# Altium project PFC_Project.PrjPcb
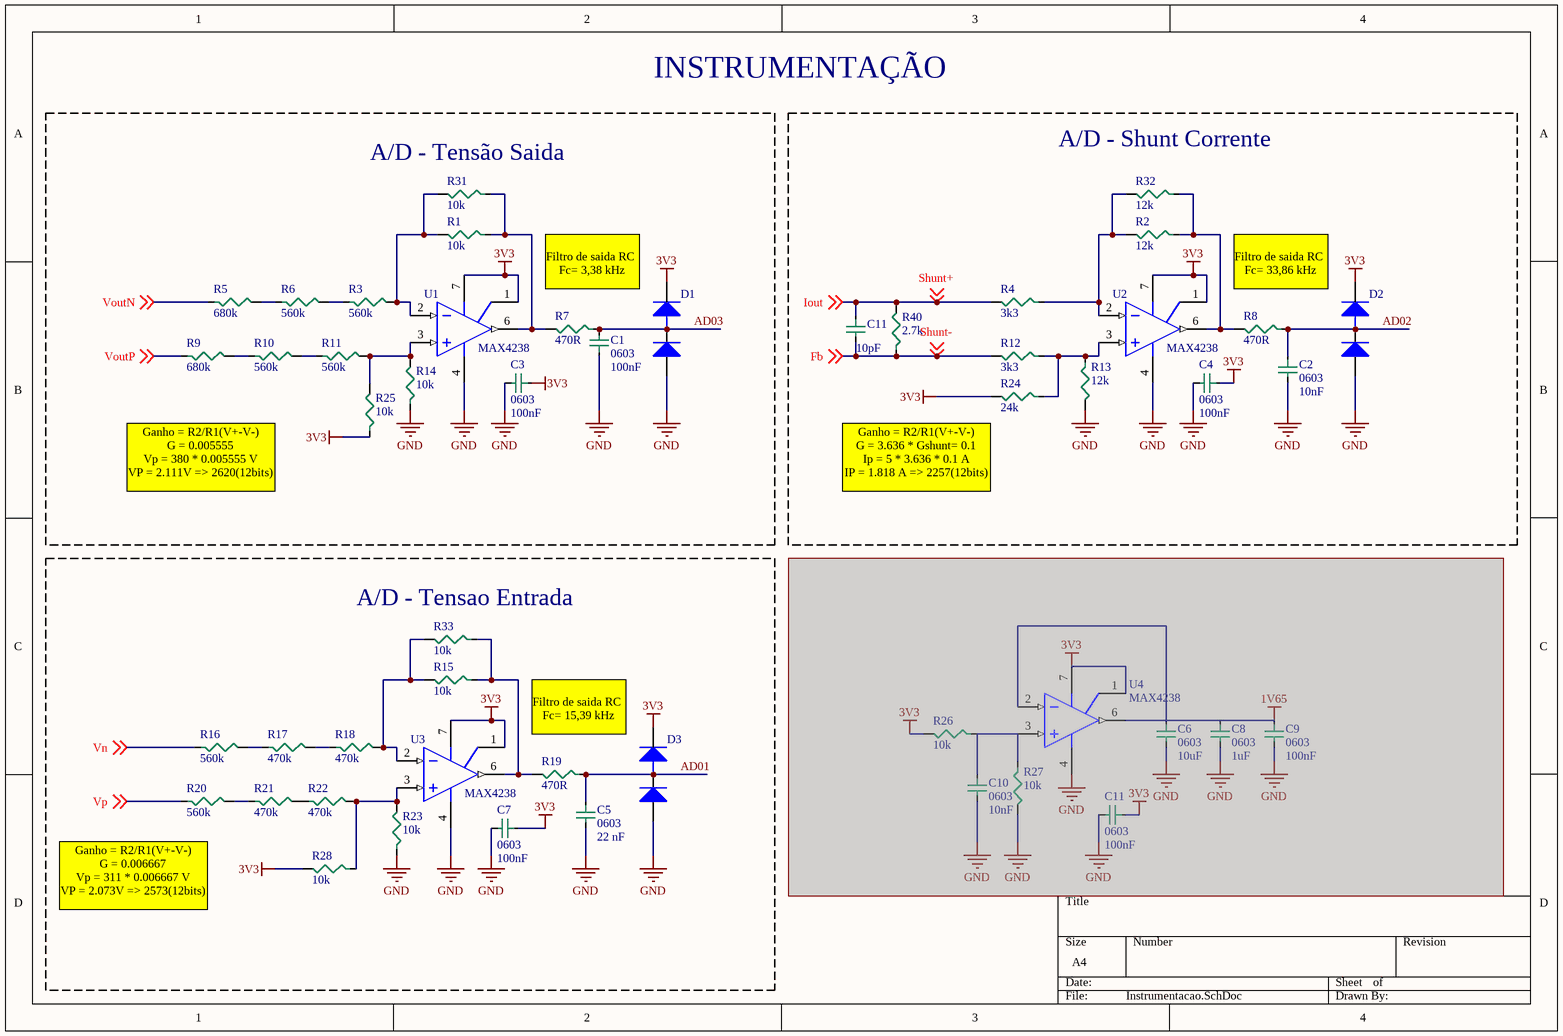
[diagram p0: Instrumentacao.SchDoc]
2 sheets, 88 parts. Net scope: global (net labels, ports and power ports of the same name join across sheets).
Board file: PCBv2.PcbDoc
Sheets:
  Instrumentacao.SchDoc
  PFC.SchDoc

## Sheet Instrumentacao.SchDoc
size A4

### Parts
(Parts that share a designator on the sheet are numbered #1, #2 ... from top to bottom, then left to right.)
C1  0603  value 100nF  [0603C]
C2  0603  value 10nF  [0603C]
C3  0603  value 100nF  [0603C]
C4  0603  value 100nF  [0603C]
C5  0603  value 22 nF  [0603C]
C6  0603  value 10uF  [0603C]  (masked out: inside a compile mask, not in the netlist)
C7  0603  value 100nF  [0603C]
C8  0603  value 1uF  [0603C]  (masked out: inside a compile mask, not in the netlist)
C9  0603  value 100nF  [0603C]  (masked out: inside a compile mask, not in the netlist)
C10  0603  value 10nF  [0603C]  (masked out: inside a compile mask, not in the netlist)
C11#1  value 10pF  [0603C]  (hidden comment: 0603)
C11#2  0603  value 100nF  [0603C]  (masked out: inside a compile mask, not in the netlist)
D1#1  BAT54S  [SOT23]  (value not drawn)
D2  BAT54S  [SOT23]  (value not drawn)
D3  BAT54S  [SOT23]  (value not drawn)
R1  value 10k  [0603]  (hidden comment: 0603)
R2  value 12k  [0603]  (hidden comment: 0603)
R3  value 560k  [0603]  (hidden comment: 0603)
R4  value 3k3  [0603]  (hidden comment: 0603)
R5  value 680k  [0603]  (hidden comment: 0603)
R6  value 560k  [0603]  (hidden comment: 0603)
R7  value 470R  [0603]  (hidden comment: 0603)
R8  value 470R  [0603]  (hidden comment: 0603)
R9  value 680k  [0603]  (hidden comment: 0603)
R10  value 560k  [0603]  (hidden comment: 0603)
R11  value 560k  [0603]  (hidden comment: 0603)
R12  value 3k3  [0603]  (hidden comment: 0603)
R13  value 12k  [0603]  (hidden comment: 0603)
R14  value 10k  [0603]  (hidden comment: 0603)
R15  value 10k  [0603]  (hidden comment: 0603)
R16  value 560k  [0603]  (hidden comment: 0603)
R17  value 470k  [0603]  (hidden comment: 0603)
R18  value 470k  [0603]  (hidden comment: 0603)
R19  value 470R  [0603]  (hidden comment: 0603)
R20  value 560k  [0603]  (hidden comment: 0603)
R21  value 470k  [0603]  (hidden comment: 0603)
R22  value 470k  [0603]  (hidden comment: 0603)
R23  value 10k  [0603]  (hidden comment: 0603)
R24  value 24k  [0603]  (hidden comment: 0603)
R25  value 10k  [0603]  (hidden comment: 0603)
R26  value 10k  [0603]  (hidden comment: 0603)  (masked out: inside a compile mask, not in the netlist)
R27  value 10k  [0603]  (hidden comment: 0603)  (masked out: inside a compile mask, not in the netlist)
R28  value 10k  [0603]  (hidden comment: 0603)
R31  value 10k  [0603]  (hidden comment: 0603)
R32  value 12k  [0603]  (hidden comment: 0603)
R33  value 10k  [0603]  (hidden comment: 0603)
R40  value 2.7k  [0603]  (hidden comment: 0603)
U1  MAX4238  [SOIC8]
U2  MAX4238  [SOIC8]
U3  MAX4238  [SOIC8]
U4  MAX4238  [SOIC8]  (masked out: inside a compile mask, not in the netlist)

### Blocks framed on the sheet
A/D - Tensão Saida: C1 C3 D1#1 R1 R3 R5-R7 R9-R11 R14 R25 R31 U1
A/D - Shunt Corrente: C2 C4 C11#1 D2 R2 R4 R8 R12 R13 R24 R32 R40 U2
A/D - Tensao Entrada: C5 C7 D3 R15-R23 R28 R33 U3

### Nets
3V3: C3.1 C4.1 C7.1 D1#1.2(K) D2.2(K) D3.2(K) R24.2 R25.1 R28.2 U1.1(BAL) U1.7(V+) U2.1(BAL) U2.7(V+) U3.1(BAL) U3.7(V+)
GND: C1.1 C2.2 C3.2 C4.2 C5.2 C7.2 D1#1.1(A) D2.1(A) D3.1(A) R13.2 R14.1 R23.1 U1.4(V-) U2.4(V-) U3.4(V-)
VoutN: R5.1 ; off-sheet VoutN  [project net A_GND]
AD01: C5.1 D3.3(M) R19.1
AD02: C2.1 D2.3(M) R8.1
AD03: C1.2 D1#1.3(M) R7.1
Fb: C11#1.2 R12.2 R40.1 ; off-sheet Shunt-, off-sheet Fb  [also labelled Shunt-]
Iout: C11#1.1 R4.2 R40.2 ; off-sheet Shunt+, off-sheet Iout  [also labelled Shunt+]
Vn: R16.1 ; off-sheet Vn  [project net Neutro]
VoutP: R9.1 ; off-sheet VoutP
Vp: R20.1 ; off-sheet Vp  [project net Fase]
NetR1_1: R1.1 R7.2 R31.1 U1.6(OUT)
NetR1_2: R1.2 R3.2 R31.2 U1.2(IN-)
NetR2_1: R2.1 R8.2 R32.1 U2.6(OUT)
NetR2_2: R2.2 R4.1 R32.2 U2.2(IN-)
NetR3_1: R3.1 R6.2
NetR5_2: R5.2 R6.1
NetR9_2: R9.2 R10.1
NetR10_2: R10.2 R11.1
NetR11_2: R11.2 R14.2 R25.2 U1.3(IN+)
NetR12_1: R12.1 R13.1 R24.1 U2.3(IN+)
NetR15_1: R15.1 R19.2 R33.1 U3.6(OUT)
NetR15_2: R15.2 R18.2 R33.2 U3.2(IN-)
NetR16_2: R16.2 R17.1
NetR17_2: R17.2 R18.1
NetR20_2: R20.2 R21.1
NetR21_2: R21.2 R22.1
NetR22_2: R22.2 R23.2 R28.1 U3.3(IN+)

### Notes on the sheet
- INSTRUMENTAÇÃO
- Filtro de saida RC
  Fc= 3,38 kHz
- Filtro de saida RC
  Fc= 33,86 kHz
- Ganho = R2/R1(V+-V-)
  G = 0.005555
  Vp = 380 * 0.005555 V
  VP = 2.111V => 2620(12bits)
- (near R24) Ganho = R2/R1(V+-V-)
  G = 3.636 * Gshunt= 0.1
  Ip = 5 * 3.636 * 0.1 A
  IP = 1.818 A => 2257(12bits)
- Filtro de saida RC
  Fc= 15,39 kHz
- (near R20) Ganho = R2/R1(V+-V-)
  G = 0.006667
  Vp = 311 * 0.006667 V
  VP = 2.073V => 2573(12bits)

### Library data of the parts
C1-C10 C11#1 C11#2 = Capacitor SMD 0603
D1#1 D2 D3 = BAT54SFSCT-ND: DIODE SCHOTTKY 20V 0.5A SOD123; Supplier 1: Digi-Key; Supplier Part Number 1: BAT54SFSCT-ND
R1-R28 R31-R33 R40 = Resistor SMD 0603 1/10 W: %: ±1%; P: 1/8W
U1-U4 = MAX4238: IC OPAMP GP 1MHZ RRO 8SOIC; Supplier 1: Digi-Key; Supplier Part Number 1: MAX4238ASA+-ND

## Sheet PFC.SchDoc
size A4
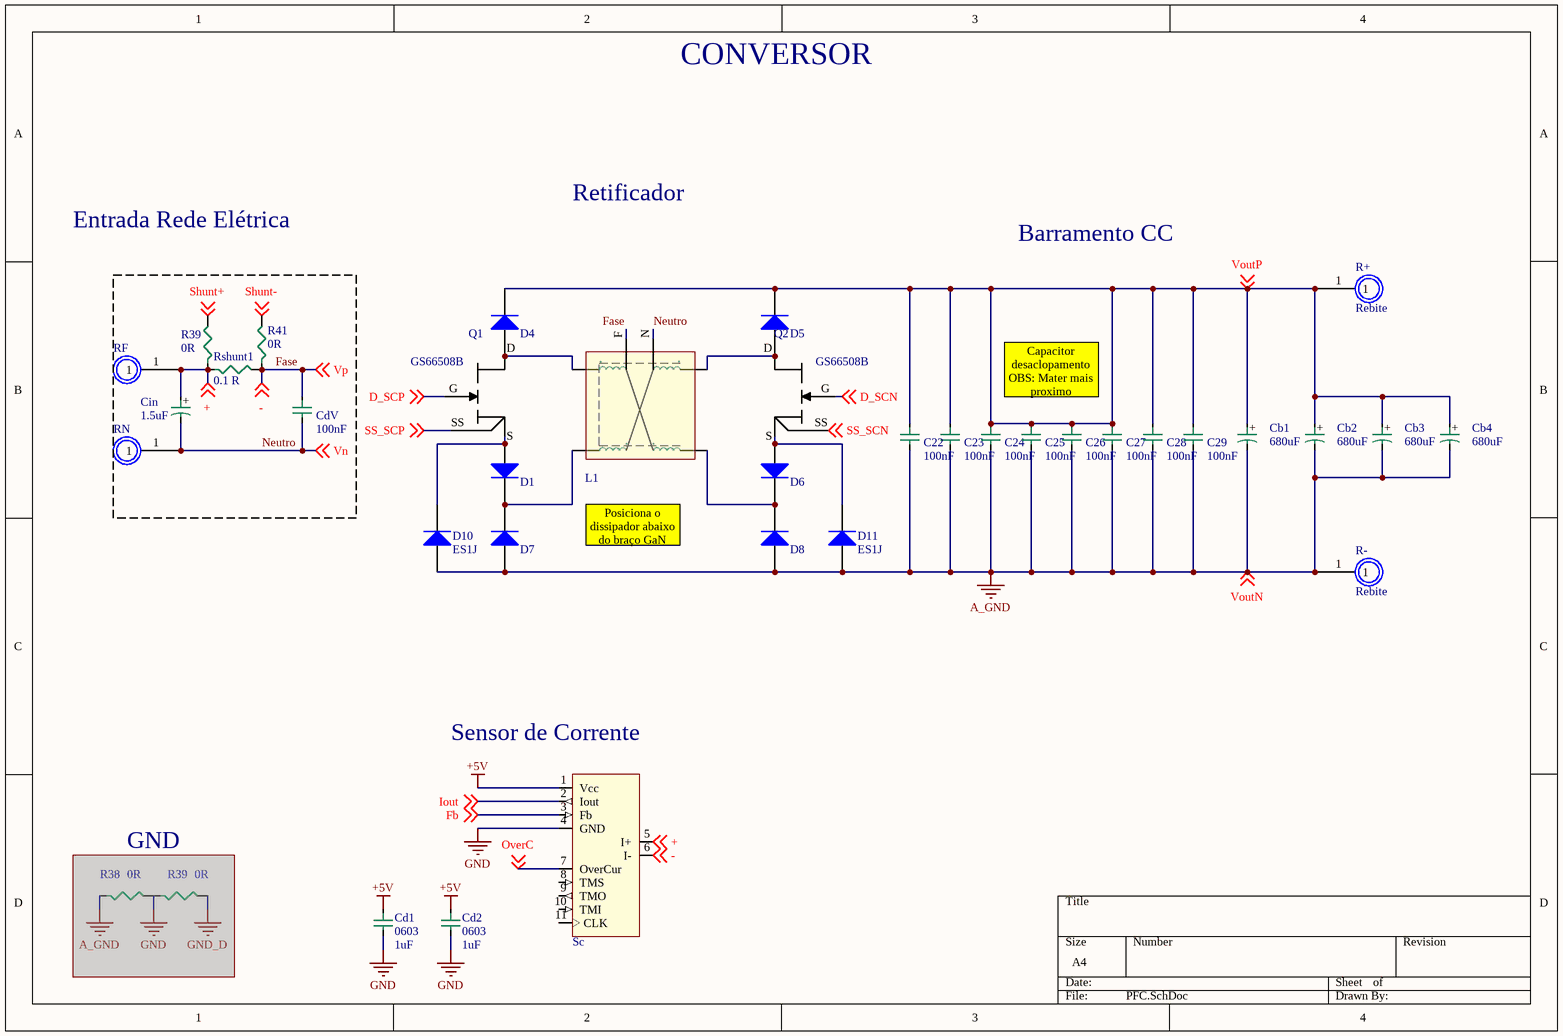
[diagram p1: PFC.SchDoc]

### Parts
(Parts that share a designator on the sheet are numbered #1, #2 ... from top to bottom, then left to right.)
C22  value 100nF  [1812C]  (hidden comment: 1812)
C23  value 100nF  [1812C]  (hidden comment: 1812)
C24  value 100nF  [1812C]  (hidden comment: 1812)
C25  value 100nF  [1812C]  (hidden comment: 1812)
C26  value 100nF  [1812C]  (hidden comment: 1812)
C27  value 100nF  [1812C]  (hidden comment: 1812)
C28  value 100nF  [1812C]  (hidden comment: 1812)
C29  value 100nF  [1812C]  (hidden comment: 1812)
Cb1  value 680uF  [CAP ALU D30 A50  DeitadoPCB]  (hidden comment: Cap 30x50 mm)
Cb2  value 680uF  [CAP ALU D30 A50  DeitadoPCBV]  (hidden comment: Cap 30x50 mm)
Cb3  value 680uF  [CAP ALU D30 A50  DeitadoPCB]  (hidden comment: Cap 30x50 mm)
Cb4  value 680uF  [CAP ALU D30 A50  DeitadoPCBV]  (hidden comment: Cap 30x50 mm)
Cd1  0603  value 1uF  [0603C]
Cd2  0603  value 1uF  [0603C]
CdV  value 100nF  [1812C]  (hidden comment: 1812)
Cin  value 1.5uF  [CAP FILM 22.5 mm Lead]  (hidden comment: Cap Film 22.5mm)
D1#2  IDL12G65C5XUMA2Diode 1N40XX  [VSON4]  (value not drawn)
D4  IDL12G65C5XUMA2Diode 1N40XX  [VSON4]  (value not drawn)
D5  IDL12G65C5XUMA2Diode 1N40XX  [VSON4]  (value not drawn)
D6  IDL12G65C5XUMA2Diode 1N40XX  [VSON4]  (value not drawn)
D7  IDL12G65C5XUMA2Diode 1N40XX  [VSON4]  (value not drawn)
D8  IDL12G65C5XUMA2Diode 1N40XX  [VSON4]  (value not drawn)
D10  ES1J  [DO-214AC]
D11  ES1J  [DO-214AC]
L1  Indutor PFC Dissertacao  [INDUTOR DISSERTACAO]  (value not drawn)
Q1  GS66508B  [GS66508B]
Q2  GS66508B  [GS66508B]
R38  value 0R  [0805]  (hidden comment: 0805)  (masked out: inside a compile mask, not in the netlist)
R39#1  value 0R  [0603]  (hidden comment: 0603)
R39#2  value 0R  [0805]  (hidden comment: 0805)  (masked out: inside a compile mask, not in the netlist)
R41  value 0R  [0603]  (hidden comment: 0603)
R+  Rebite  [Rebite]
R-  Rebite  [Rebite]
RF  Rebite  [Rebite]  (value not drawn)
RN  Rebite  [Rebite]  (value not drawn)
Rshunt1  value 0.1 R  [WSHM]  (hidden comment: WSHM28189L000FEA)
Sc  Sensor Corrente Diss CFS1000  [Sensor Corrente Diss CFS1000]  (value not drawn)

### Nets
+5V: Cd1.1 Cd2.1 Sc.1(Vcc)
A_GND: C22.2 C23.2 C24.2 C25.2 C26.2 C27.2 C28.2 C29.2 Cb1.2 Cb2.2 Cb3.2 Cb4.2 D7.1(A) D8.1(A) D10.1(A) D11.1(A) R-.1 ; off-sheet VoutN  [also labelled VoutN]
GND: Cd1.2 Cd2.2 Sc.4(GND)
+: Cin.1 R39#1.1 RF.1 Rshunt1.1 Sc.5(I+) ; off-sheet +
D_SCN: Q2.G ; off-sheet D_SCN
D_SCP: Q1.G ; off-sheet D_SCP
Fase: CdV.1 L1.F R41.1 Rshunt1.2 Sc.6(I-) ; off-sheet Vp, off-sheet -  [also labelled -, Vp]
Fb: R41.2 Sc.3(Fb) ; off-sheet Fb, off-sheet Shunt-  [also labelled Shunt-]
Iout: R39#1.2 Sc.2(Iout) ; off-sheet Iout, off-sheet Shunt+  [also labelled Shunt+]
Neutro: CdV.2 Cin.2 L1.N RN.1 ; off-sheet Vn  [also labelled Vn]
OverC: Sc.7(OverCur) ; off-sheet OverC
SS_SCN: Q2.SS ; off-sheet SS_SCN
SS_SCP: Q1.SS ; off-sheet SS_SCP
VoutP: C22.1 C23.1 C24.1 C25.1 C26.1 C27.1 C28.1 C29.1 Cb1.1 Cb2.1 Cb3.1 Cb4.1 D4.2(K) D5.2(K) R+.1 ; off-sheet VoutP
NetD1#2_1: D1#2.1(A) D10.2(K) Q1.S
NetD1#2_2: D1#2.2(K) D7.2(K) L1.2
NetD4_1: D4.1(A) L1.1 Q1.D
NetD5_1: D5.1(A) L1.3 Q2.D
NetD6_1: D6.1(A) D11.2(K) Q2.S
NetD6_2: D6.2(K) D8.2(K) L1.4

Not connected (* = marked no-connect by the designer): Sc 8(TMS) 9(TMO) 10(TMI) 11(CLK)

### Notes on the sheet
- CONVERSOR
- Entrada Rede Elétrica
- Retificador
- Barramento CC
- Capacitor desaclopamento
  OBS: Mater mais proximo
  do braço do conversor.
- Posiciona o dissipador abaixo do braço GaN
- (near Sc) Sensor de Corrente
- GND
- (in symbol Capacitor ALU 30x50 mm) +
- (in symbol Capacitor FILM 22.5mm) +

### Library data of the parts
C22-C29 CdV = Capacitor SMD 1812
Cb1-Cb4 = Capacitor ALU 30x50 mm: Capacitor 30x50 mm; %: ±20%; Tensão: 200V
Cd1 Cd2 = Capacitor SMD 0603
Cin = Capacitor FILM 22.5mm: Film Capacitors 310volts 1.5uF 10%; %: ±20%; Tensão: 200V; ComponentLink1Description: Mouser; ComponentLink1URL: https://br.mouser.com/ProductDetail/80-F863DV155M310L
D1#2 D4-D8 = IDL12G65C5XUMA2: DIODE SCHOTTKY 650V 12A VSON-4; ComponentLink1Description: DIGI; ComponentLink1URL: https://www.digikey.com/product-detail/en/infineon-technologies/IDL12G65C5XUMA2/IDL12G65C5XUMA2-ND/7313875
D10 D11 = Diode ES1J: Rectifiers 1.0 A Ultra Fast Recovery Rect; ComponentLink1Description: MOUSER; ComponentLink1URL: https://br.mouser.com/ProductDetail/512-ES1J; ComponentLink2Description: DATASHEET; ComponentLink2URL: https://br.mouser.com/datasheet/2/308/ES1J-D-1804952.pdf
L1 = Indutor PFC Dissertacao: Indutor; Value: 32uH
Q1 Q2 = GS66508B: GAN TRANS E-MODE 650V 30A
R38 R39#2 = Resistor SMD 0805 1/8 W: %: ±1%; P: 1/8W
R39#1 R41 = Resistor SMD 0603 1/10 W: %: ±1%; P: 1/8W
Rshunt1 = Resistor shunt SMD 7 W: 7W Chip Resistor Nonstandard Automotive AEC-Q200, Current Sense, Moisture Resistant, Pulse Withstanding Metal Element; %: ±1%; P: 3W
Sc = Sensor Corrente Diss CFS1000: Sensor Corrente Dissertação CFS1000

## Nets that join several sheets
A_GND: Instrumentacao (R5.1), PFC (17 pins)
GND: Instrumentacao (15 pins), PFC (Cd1.2 Cd2.2 Sc.4)
Fase: Instrumentacao (R20.1), PFC (5 pins)
Fb: Instrumentacao (C11#1.2 R12.2 R40.1), PFC (R41.2 Sc.3)
Iout: Instrumentacao (C11#1.1 R4.2 R40.2), PFC (R39#1.2 Sc.2)
Neutro: Instrumentacao (R16.1), PFC (CdV.2 Cin.2 L1.N RN.1)
VoutP: Instrumentacao (R9.1), PFC (15 pins)